# EAGLE board sinobit (EAGLE 6.1), part 1 of 2
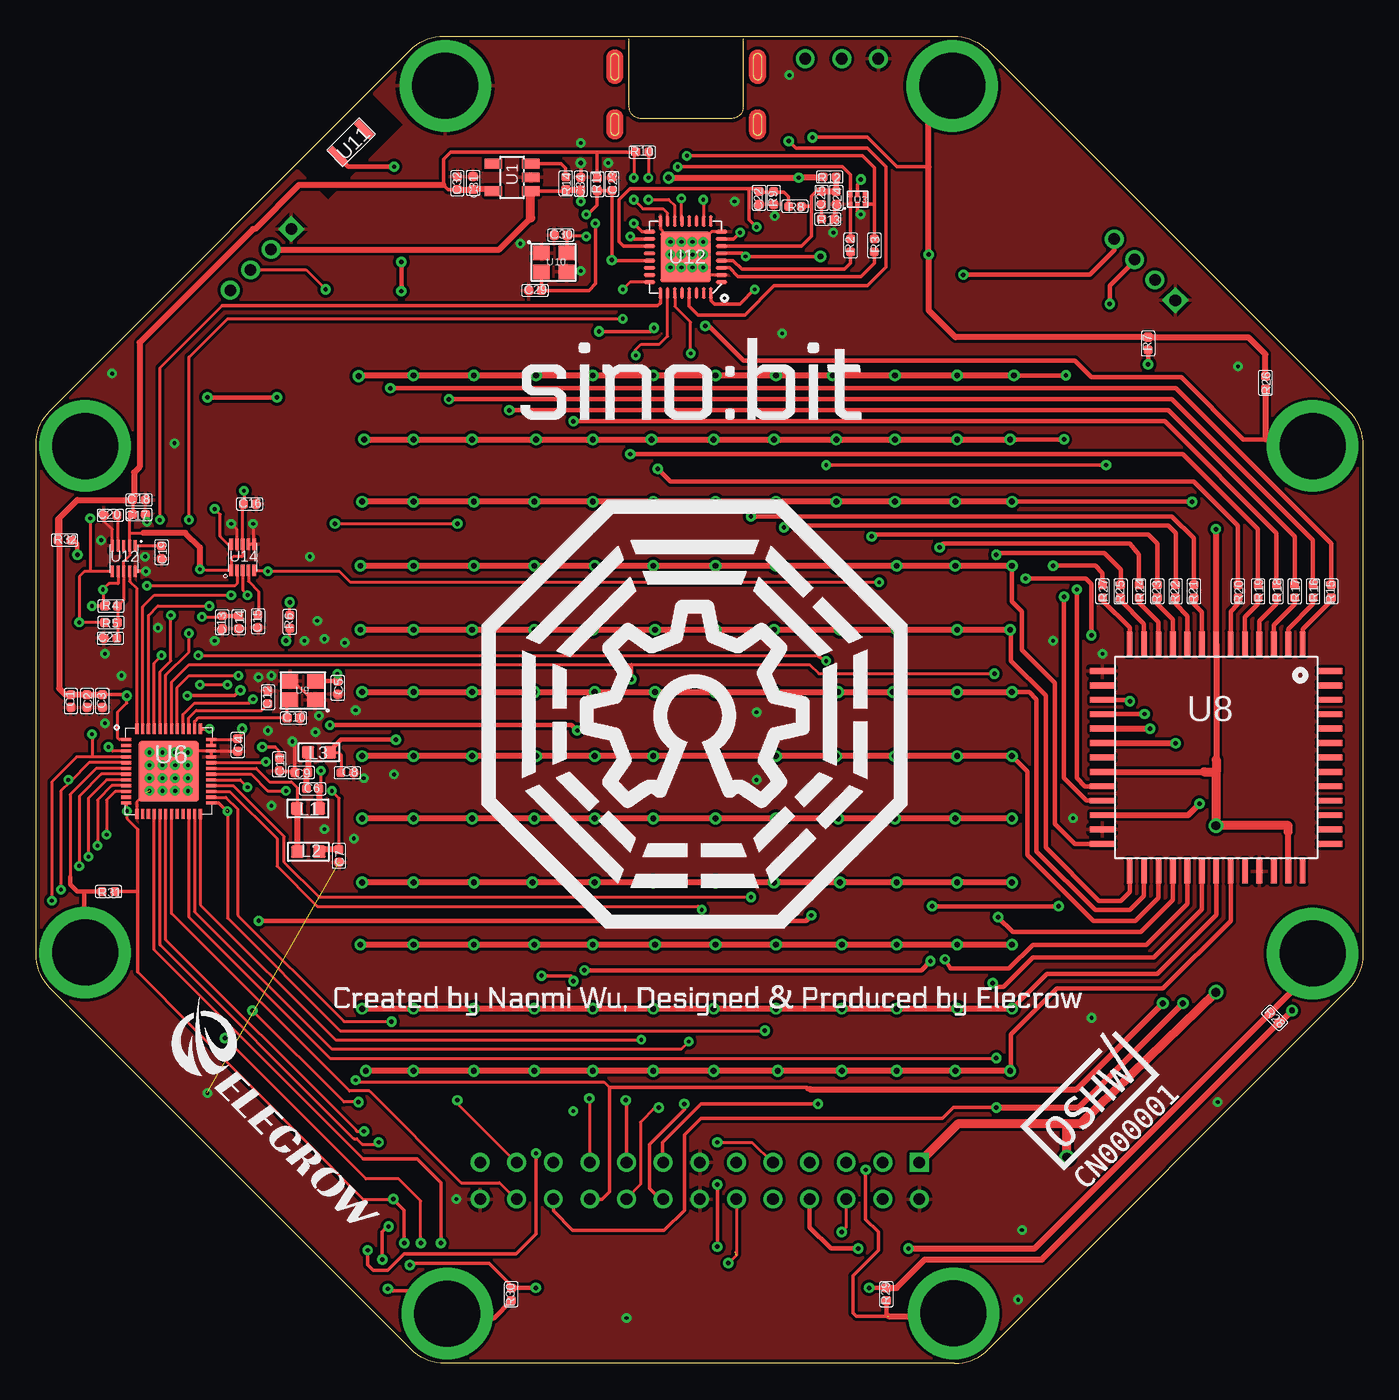
[diagram p2: board, top side]
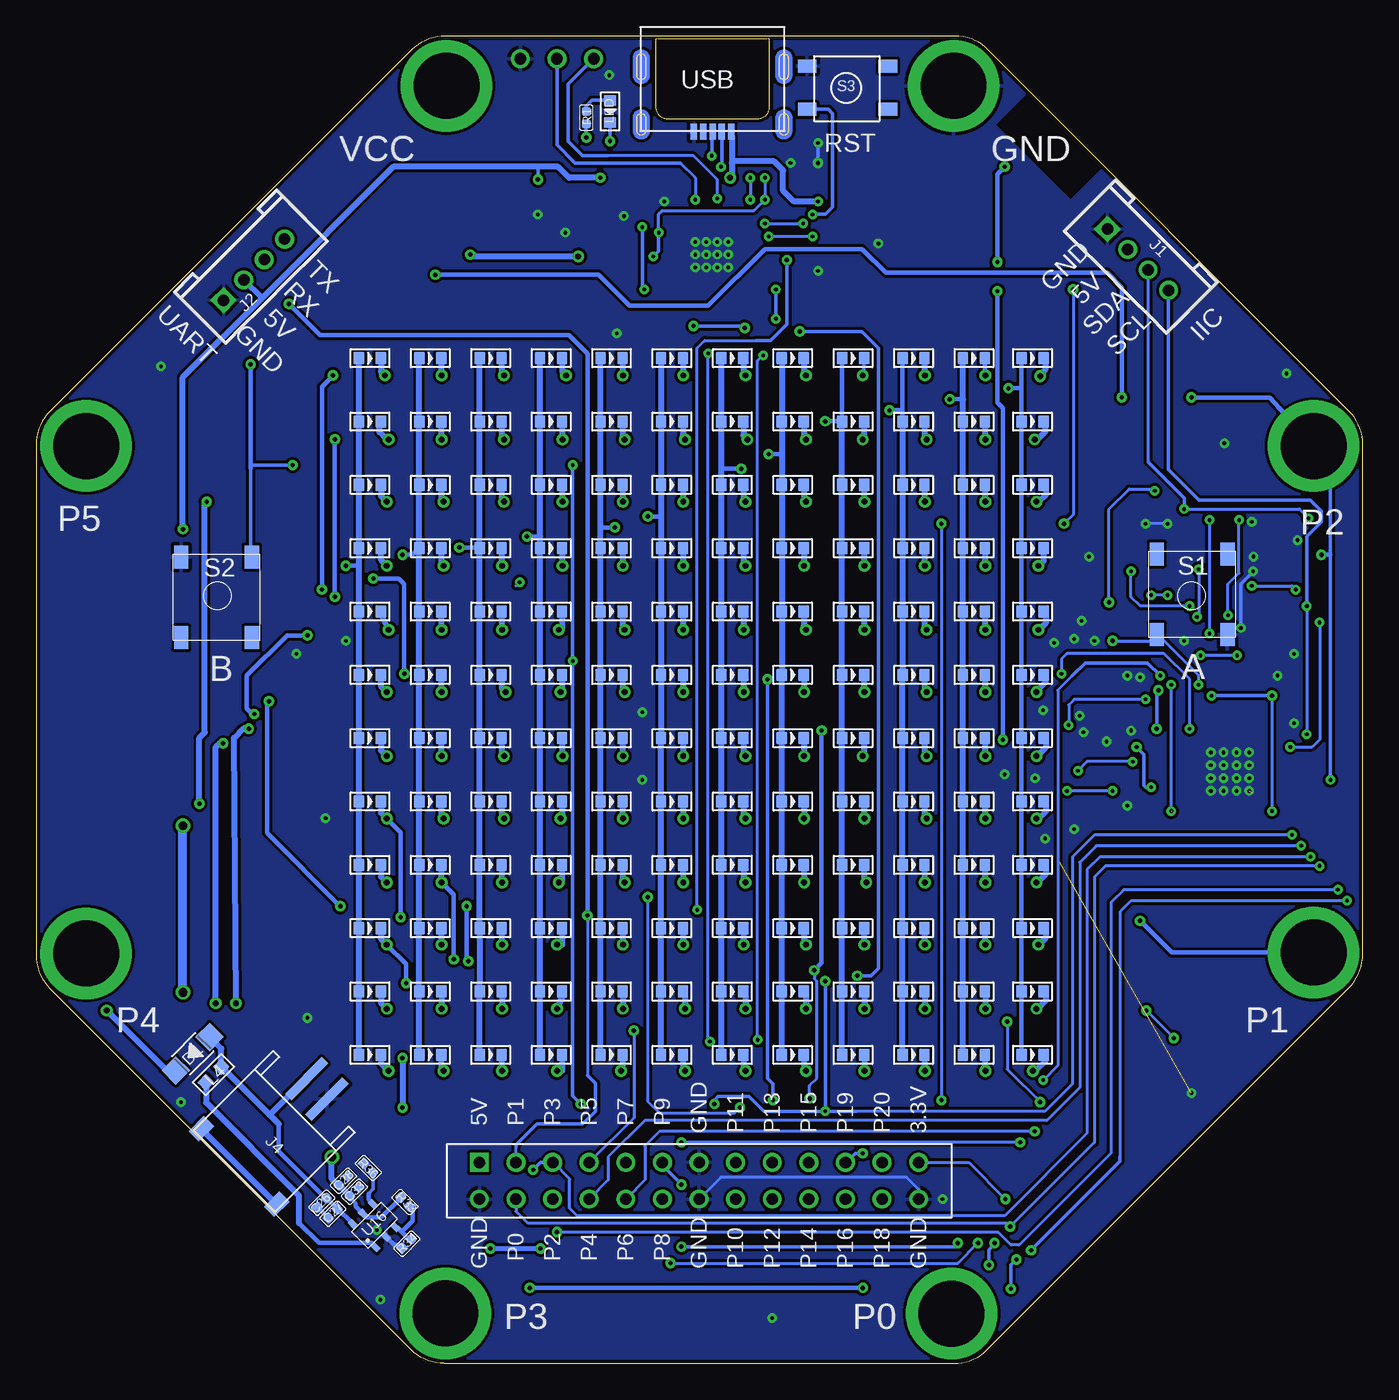
[diagram p3: board, bottom side, seen from below]

Size 92.05 x 92.1 mm. Coordinates in mm from the lower left corner, seen from the top.
Outline: 63.73,0 28.37,0 arc-45 26.03,0.97 0.97,26.06 arc-45 0,28.39 0,63.76 arc-45 0.97,66.09 25.96,91.13 arc-45 28.29,92.1 63.66,92.1 arc-45 65.99,91.13 91.08,66.07 arc-45 92.05,63.73 92.05,28.37 arc-45 91.08,26.03 66.07,0.97 arc-45 63.73,0
Copper layers (1*16): Top 0.035mm / dielectric 1.5mm / Bottom 0.035mm
Design rules: minimum track width 8mil, minimum drill 8mil, track to track 8mil, track to pad 8mil, pad to pad 8mil, via to via 8mil, smd to smd 0mil, copper to edge 10mil, drill to drill 8mil, minimum pad ring 10mil, minimum via ring 8mil, stop-mask expansion 4mil, vias tented up to drill 100mil, thermal gap 10mil
Net classes: 0 default: width 0.003 mm, drill 0.254 mm, clearance 0.152 mm

## Footprints (pad centres in the part's own frame; a part is rotated, then mirrored left to right if it is on the bottom)
C0402 = smd 0.635 x 0.635: 1 -0.445,0; 2 0.445,0
SOD123 = smd 1.397 x 1.397: + -1.651,0; - 1.651,0
D0603 = smd 0.762 x 0.889: + -0.762,0; - 0.762,0
2.0_1X4 = drill 0.8 pad 1.27 square: 1 -3,0 | drill 0.8 pad 1.27: 2 -1,0; 3 1,0; 4 3,0
JST-SMD-2.0-90D = smd 1 x 1.5: 3 3.7,-2.54; 4 -3.7,-2.54 | smd 0.635 x 3.6: + -1,5.08; - 1,5.08
L0603 = smd 0.889 x 0.889: 1 -0.762,0; 2 0.762,0
R0402 = smd 0.635 x 0.635: 1 -0.445,0; 2 0.445,0
SWITCH = smd 1.6 x 1: 1 -2.7,2.4; 2 2.9,2.4; 3 -2.7,-2.5; 4 2.9,-2.5
SWITC4.5X4.5 = smd 1.3 x 0.9: P$1 -0.5,3.8; P$2 -0.5,0.8; P$3 5.1,0.8; P$4 5.1,3.8
SOT23-5 = smd 0.69 x 1.2: 1 -0.95,-1.3; 2 0,-1.3; 3 0.95,-1.3; 4 0.95,1.3; 5 -0.95,1.3
MAG3110 = smd 0.8 x 0.22: P1 -0.816,0.846; P2 -0.816,0.446; P3 -0.816,0.046; P4 -0.816,-0.354; P5 -0.816,-0.754; P6 0.984,-0.754; P7 0.984,-0.354; P8 0.984,0.046; P9 0.984,0.446; P10 0.984,0.846
PRTR5V0U2F_SOT886 = smd 0.325 x 0.27: P1 -0.3,0.5; P2 -0.3,0; P3 -0.3,-0.5; P4 0.375,-0.5; P5 0.375,0; P6 0.375,0.5
NRF51822 = smd 0.7 x 0.22: 1 -2.95,2; 2 -2.95,1.6; 3 -2.95,1.2; 4 -2.95,0.8; 5 -2.95,0.4; 6 -2.95,0; 7 -2.95,-0.4; 8 -2.95,-0.8; 9 -2.95,-1.2; 10 -2.95,-1.6; 11 -2.95,-2; 12 -2.95,-2.4; 25 2.95,-2.4; 26 2.95,-2; 27 2.95,-1.6; 28 2.95,-1.2; 29 2.95,-0.8; 30 2.95,-0.4; 31 2.95,0; 32 2.95,0.4; 33 2.95,0.8; 34 2.95,1.2; 35 2.95,1.6; 36 2.95,2 | smd 0.22 x 0.7: 13 -2.2,-3.15; 14 -1.8,-3.15; 15 -1.4,-3.15; 16 -1,-3.15; 17 -0.6,-3.15; 18 -0.2,-3.15; 19 0.2,-3.15; 20 0.6,-3.15; 21 1,-3.15; 22 1.4,-3.15; 23 1.8,-3.15; 24 2.2,-3.15; 37 2.2,2.75; 38 1.8,2.75; 39 1.4,2.75; 40 1,2.75; 41 0.6,2.75; 42 0.2,2.75; 43 -0.2,2.75; 44 -0.6,2.75; 45 -1,2.75; 46 -1.4,2.75; 47 -1.8,2.75; 48 -2.2,2.75 | smd 4.2 x 4.2: P$14 0,-0.2
HT1632C = smd 0.4 x 1.7: P$8 -5.35,-7.25; P$9 -4.35,-7.25; P$10 -3.35,-7.25; P$11 -2.35,-7.25; P$12 -1.35,-7.25; P$13 -0.35,-7.25; P$14 0.65,-7.25; P$15 1.65,-7.25; P$16 2.65,-7.25; P$17 3.65,-7.25; P$18 4.65,-7.25; P$19 5.65,-7.25; P$20 6.65,-7.25; P$34 -5.35,8.55; P$35 -4.35,8.55; P$36 -3.35,8.55; P$37 -2.35,8.55; P$38 -1.35,8.55; P$39 -0.35,8.55; P$40 0.65,8.55; P$41 1.65,8.55; P$42 2.65,8.55; P$43 3.65,8.55; P$44 4.65,8.55; P$45 5.65,8.55; P$46 6.65,8.55 | smd 1.7 x 0.4: P$21 8.55,-5.35; P$22 8.55,-4.35; P$23 8.55,-3.35; P$24 8.55,-2.35; P$25 8.55,-1.35; P$26 8.55,-0.35; P$27 8.55,0.65; P$28 8.55,1.65; P$29 8.55,2.65; P$30 8.55,3.65; P$31 8.55,4.65; P$32 8.55,5.65; P$33 8.55,6.65; P$47 -7.25,-5.35; P$48 -7.25,-4.35; P$49 -7.25,-3.35; P$50 -7.25,-2.35; P$51 -7.25,-1.35; P$52 -7.25,-0.35; P$53 -7.25,0.65; P$54 -7.25,1.65; P$55 -7.25,2.65; P$56 -7.25,3.65; P$57 -7.25,4.65; P$58 -7.25,5.65; P$59 -7.25,6.65
16MHZ2520 = smd 1.15 x 1: 1 2.6,0; 2 4.35,0; 3 4.35,1.3; 4 2.6,1.3
TIANXIAN = smd 0.5 x 1.47: P$1 0.3,0.8; P$2 2.9,0.8
MKL26Z168VFM4 = smd 0.8 x 0.27: 1 -2.6,1.75; 2 -2.6,1.25; 3 -2.6,0.75; 4 -2.6,0.25; 5 -2.6,-0.25; 6 -2.6,-0.75; 7 -2.6,-1.25; 8 -2.6,-1.75; 17 2.4,-1.75; 18 2.4,-1.25; 19 2.4,-0.75; 20 2.4,-0.25; 21 2.4,0.25; 22 2.4,0.75; 23 2.4,1.25; 24 2.4,1.75 | smd 0.27 x 0.8: 9 -1.85,-2.5; 10 -1.35,-2.5; 11 -0.85,-2.5; 12 -0.35,-2.5; 13 0.15,-2.5; 14 0.65,-2.5; 15 1.15,-2.5; 16 1.65,-2.5; 25 1.65,2.5; 26 1.15,2.5; 27 0.65,2.5; 28 0.15,2.5; 29 -0.35,2.5; 30 -0.85,2.5; 32 -1.85,2.5 | smd 0.26 x 0.8: 31 -1.35,2.5 | smd 3.5 x 3.5: P$9 -0.1,0
MMA8653FC = smd 0.8 x 0.26: 6 1.92,0.2; 7 1.92,0.6; 8 1.92,1; 9 1.92,1.4; 10 1.92,1.8; P1 0.1,1.8; P2 0.1,1.4; P3 0.1,1; P4 0.1,0.6; P5 0.1,0.2
PS7516 = smd 0.4 x 0.6: P1 -1.07,-1.14; P2 -0.05,-1.14; P3 0.9,-1.14; P4 0.9,1.14; P5 -0.05,1.14; P6 -1.07,1.14
PAD-D = drill 0.8: P$1 0,0
26PIN = drill 0.8 square: P$1 0,0 | drill 0.8: P$2 2.54,0; P$3 5.08,0; P$4 7.62,0; P$5 10.16,0; P$6 12.7,0; P$7 15.24,0; P$8 17.78,0; P$9 20.32,0; P$10 22.86,0; P$11 25.4,0; P$12 27.94,0; P$13 30.48,0; P$14 30.48,-2.54; P$15 27.94,-2.54; P$16 25.4,-2.54; P$17 22.86,-2.54; P$18 20.32,-2.54; P$19 17.78,-2.54; P$20 15.24,-2.54; P$21 12.7,-2.54; P$22 10.16,-2.54; P$23 7.62,-2.54; P$24 5.08,-2.54; P$25 2.54,-2.54; P$26 0,-2.54
焊盘1 = drill 4.572 pad 6.35: P$1 0,0
47642-0001 = smd 0.45 x 1.1: 1 -1.3,6.47; 2 -0.65,6.47; 3 0,6.47; 4 0.65,6.47; 5 1.3,6.47

## Placement (x,y rotation side)
C1  4.7uf  [C0402]  2.42,45.96 90 top
C2  100nf  [C0402]  3.53,45.96 90 top
C3  100nf  [C0402]  4.6,45.96 90 top
C4  100nf  [C0402]  13.99,42.91 90 top
C5  12pF  [C0402]  20.93,46.88 270 top
C6  2.2pf  [C0402]  19.19,39.87 180 top
C7  2.2nf  [C0402]  21.02,35.22 270 top
C8  1.5pf  [C0402]  21.6,40.98 0 top
C9  0.8pf  [C0402]  18.4,41.01 180 top
C10  12pF  [C0402]  17.87,44.78 0 top
C11  47nF  [C0402]  16.87,41.57 270 top
C12  100nF  [C0402]  16.1,46.21 90 top
C13  100nF  [C0402]  12.92,51.42 90 top
C14  1uF  [C0402]  14.06,51.42 90 top
C15  100nF  [C0402]  15.4,51.5 90 top
C16  100nF  [C0402]  14.82,59.63 0 top
C17  100nF  [C0402]  7.14,58.9 180 top
C18  1uF  [C0402]  7.14,59.92 180 top
C19  100nF  [C0402]  8.71,56.29 270 top
C20  100nF  [C0402]  5.16,58.85 0 top
C21  100nF  [C0402]  5.16,50.32 0 top
C22  100nF  [C0402]  50.16,80.87 90 top
C23  100nF  [C0402]  39.95,81.84 270 top
C24  100nF  [C0402]  55.52,80.87 90 top
C25  1uF  [C0402]  54.51,80.87 90 top
C26  0.1uF  [C0402]  72.21,11.15 45 bottom
C27  10uF  [C0402]  71.45,10.39 45 bottom
C28  0.1uF  [C0402]  70.71,12.67 225 bottom
C29  6.8pF  [C0402]  34.62,74.45 0 top
C30  6.8pF  [C0402]  36.4,78.28 0 top
C31  1uF  [C0402]  30.32,81.9 270 top
C32  10uF  [C0402]  29.24,81.89 270 top
C33  10uF  [C0402]  69.95,11.91 225 bottom
C34  10uF  [C0402]  37.8,81.85 270 top
D1  MBR0520  [SOD123]  81.18,21.49 225 bottom
E$1  [文字]  20.27,23.47 0 top
E$2  [SINOBIT2]  32.59,64.87 0 top
E$3  [ELECEOW]  8.08,22.45 315 top
E$4  [SINOBIT编号]  72.97,11.66 45 top
E$5  [XXX]  30.94,30.2 0 top
EB  RED  [D0603]  68.88,69.75 0 bottom
EB1  RED  [D0603]  68.88,65.35 0 bottom
EB2  RED  [D0603]  68.88,60.96 0 bottom
EB3  RED  [D0603]  68.88,56.57 0 bottom
EB4  RED  [D0603]  68.88,52.17 0 bottom
EB5  RED  [D0603]  68.88,47.78 0 bottom
EB6  RED  [D0603]  68.88,43.38 0 bottom
EB7  RED  [D0603]  68.88,38.99 0 bottom
EB8  RED  [D0603]  68.88,34.59 0 bottom
EB9  RED  [D0603]  68.88,30.2 0 bottom
EB10  RED  [D0603]  68.88,25.81 0 bottom
EB11  RED  [D0603]  68.88,21.41 0 bottom
EB12  RED  [D0603]  64.69,69.75 0 bottom
EB13  RED  [D0603]  64.69,65.35 0 bottom
EB14  RED  [D0603]  64.69,60.96 0 bottom
EB15  RED  [D0603]  64.69,56.57 0 bottom
EB16  RED  [D0603]  64.69,52.17 0 bottom
EB17  RED  [D0603]  64.69,47.78 0 bottom
EB18  RED  [D0603]  64.69,43.38 0 bottom
EB19  RED  [D0603]  64.69,38.99 0 bottom
EB20  RED  [D0603]  64.69,34.59 0 bottom
EB21  RED  [D0603]  64.69,30.2 0 bottom
EB22  RED  [D0603]  64.69,25.81 0 bottom
EB23  RED  [D0603]  64.69,21.41 0 bottom
EB24  RED  [D0603]  60.5,69.75 0 bottom
EB25  RED  [D0603]  60.5,65.35 0 bottom
EB26  RED  [D0603]  60.5,60.96 0 bottom
EB27  RED  [D0603]  60.5,56.57 0 bottom
EB28  RED  [D0603]  60.5,52.17 0 bottom
EB29  RED  [D0603]  60.5,47.78 0 bottom
EB30  RED  [D0603]  60.5,43.38 0 bottom
EB31  RED  [D0603]  60.5,38.99 0 bottom
EB32  RED  [D0603]  60.5,34.59 0 bottom
EB33  RED  [D0603]  60.5,30.2 0 bottom
EB34  RED  [D0603]  60.5,25.81 0 bottom
EB35  RED  [D0603]  60.5,21.41 0 bottom
EB36  RED  [D0603]  56.31,69.75 0 bottom
EB37  RED  [D0603]  56.31,65.35 0 bottom
EB38  RED  [D0603]  56.31,60.96 0 bottom
EB39  RED  [D0603]  56.31,56.57 0 bottom
EB40  RED  [D0603]  56.31,52.17 0 bottom
EB41  RED  [D0603]  56.31,47.78 0 bottom
EB42  RED  [D0603]  56.31,43.38 0 bottom
EB43  RED  [D0603]  56.31,38.99 0 bottom
EB44  RED  [D0603]  56.31,34.59 0 bottom
EB45  RED  [D0603]  56.31,30.2 0 bottom
EB46  RED  [D0603]  56.31,25.81 0 bottom
EB47  RED  [D0603]  56.31,21.41 0 bottom
EB48  RED  [D0603]  52.12,69.75 0 bottom
EB49  RED  [D0603]  52.12,65.35 0 bottom
EB50  RED  [D0603]  52.12,60.96 0 bottom
EB51  RED  [D0603]  52.12,56.57 0 bottom
EB52  RED  [D0603]  52.12,52.17 0 bottom
EB53  RED  [D0603]  52.12,47.78 0 bottom
EB54  RED  [D0603]  52.12,43.38 0 bottom
EB55  RED  [D0603]  52.12,38.99 0 bottom
EB56  RED  [D0603]  52.12,34.59 0 bottom
EB57  RED  [D0603]  52.12,30.2 0 bottom
EB58  RED  [D0603]  52.12,25.81 0 bottom
EB59  RED  [D0603]  52.12,21.41 0 bottom
EB60  RED  [D0603]  47.93,69.75 0 bottom
EB61  RED  [D0603]  47.93,65.35 0 bottom
EB62  RED  [D0603]  47.93,60.96 0 bottom
EB63  RED  [D0603]  47.93,56.57 0 bottom
EB64  RED  [D0603]  47.93,52.17 0 bottom
EB65  RED  [D0603]  47.93,47.78 0 bottom
EB66  RED  [D0603]  47.93,43.38 0 bottom
EB67  RED  [D0603]  47.93,38.99 0 bottom
EB68  RED  [D0603]  47.93,34.59 0 bottom
EB69  RED  [D0603]  47.93,30.2 0 bottom
EB70  RED  [D0603]  47.93,25.81 0 bottom
EB71  RED  [D0603]  47.93,21.41 0 bottom
EB72  RED  [D0603]  43.74,69.75 0 bottom
EB73  RED  [D0603]  43.74,65.35 0 bottom
EB74  RED  [D0603]  43.74,60.96 0 bottom
EB75  RED  [D0603]  43.74,56.57 0 bottom
EB76  RED  [D0603]  43.74,52.17 0 bottom
EB77  RED  [D0603]  43.74,47.78 0 bottom
EB78  RED  [D0603]  43.74,43.38 0 bottom
EB79  RED  [D0603]  43.74,38.99 0 bottom
EB80  RED  [D0603]  43.74,34.59 0 bottom
EB81  RED  [D0603]  43.74,30.2 0 bottom
EB82  RED  [D0603]  43.74,25.81 0 bottom
EB83  RED  [D0603]  43.74,21.41 0 bottom
EB84  RED  [D0603]  39.55,69.75 0 bottom
EB85  RED  [D0603]  39.55,65.35 0 bottom
EB86  RED  [D0603]  39.55,60.96 0 bottom
EB87  RED  [D0603]  39.55,56.57 0 bottom
EB88  RED  [D0603]  39.55,52.17 0 bottom
EB89  RED  [D0603]  39.55,47.78 0 bottom
EB90  RED  [D0603]  39.55,43.38 0 bottom
EB91  RED  [D0603]  39.55,38.99 0 bottom
EB92  RED  [D0603]  39.55,34.59 0 bottom
EB93  RED  [D0603]  39.55,30.2 0 bottom
EB94  RED  [D0603]  39.55,25.81 0 bottom
EB95  RED  [D0603]  39.55,21.41 0 bottom
EB96  RED  [D0603]  35.36,69.75 0 bottom
EB97  RED  [D0603]  35.36,65.35 0 bottom
EB98  RED  [D0603]  35.36,60.96 0 bottom
EB99  RED  [D0603]  35.36,56.57 0 bottom
EB100  RED  [D0603]  35.36,52.17 0 bottom
EB101  RED  [D0603]  35.36,47.78 0 bottom
EB102  RED  [D0603]  35.36,43.38 0 bottom
EB103  RED  [D0603]  35.36,38.99 0 bottom
EB104  RED  [D0603]  35.36,34.59 0 bottom
EB105  RED  [D0603]  35.36,30.2 0 bottom
EB106  RED  [D0603]  35.36,25.81 0 bottom
EB107  RED  [D0603]  35.36,21.41 0 bottom
EB108  RED  [D0603]  31.17,69.75 0 bottom
EB109  RED  [D0603]  31.17,65.35 0 bottom
EB110  RED  [D0603]  31.17,60.96 0 bottom
EB111  RED  [D0603]  31.17,56.57 0 bottom
EB112  RED  [D0603]  31.17,52.17 0 bottom
EB113  RED  [D0603]  31.17,47.78 0 bottom
EB114  RED  [D0603]  31.17,43.38 0 bottom
EB115  RED  [D0603]  31.17,38.99 0 bottom
EB116  RED  [D0603]  31.17,34.59 0 bottom
EB117  RED  [D0603]  31.17,30.2 0 bottom
EB118  RED  [D0603]  31.17,25.81 0 bottom
EB119  RED  [D0603]  31.17,21.41 0 bottom
EB120  RED  [D0603]  26.97,69.75 0 bottom
EB121  RED  [D0603]  26.97,65.35 0 bottom
EB122  RED  [D0603]  26.97,60.96 0 bottom
EB123  RED  [D0603]  26.97,56.57 0 bottom
EB124  RED  [D0603]  26.97,52.17 0 bottom
EB125  RED  [D0603]  26.97,47.78 0 bottom
EB126  RED  [D0603]  26.97,43.38 0 bottom
EB127  RED  [D0603]  26.97,38.99 0 bottom
EB128  RED  [D0603]  26.97,34.59 0 bottom
EB129  RED  [D0603]  26.97,30.2 0 bottom
EB130  RED  [D0603]  26.97,25.81 0 bottom
EB131  RED  [D0603]  26.97,21.41 0 bottom
EB132  RED  [D0603]  22.91,69.75 0 bottom
EB133  RED  [D0603]  22.91,65.35 0 bottom
EB134  RED  [D0603]  22.91,60.96 0 bottom
EB135  RED  [D0603]  22.91,56.57 0 bottom
EB136  RED  [D0603]  22.91,52.17 0 bottom
EB137  RED  [D0603]  22.91,47.78 0 bottom
EB138  RED  [D0603]  22.91,43.38 0 bottom
EB139  RED  [D0603]  22.91,38.99 0 bottom
EB140  RED  [D0603]  22.91,34.59 0 bottom
EB141  RED  [D0603]  22.91,30.2 0 bottom
EB142  RED  [D0603]  22.91,25.81 0 bottom
EB143  RED  [D0603]  22.91,21.41 0 bottom
J1  TWIG_2.0  [2.0_1X4]  15.6,76.59 315 bottom
J2  TWIG_2.0  [2.0_1X4]  76.93,75.89 45 bottom
J4  [JST-SMD-2.0-90D]  76.17,15.46 315 bottom
L1  4.7nH  [L0603]  18.87,38.51 180 top
L2  10nH  [L0603]  18.9,35.5 0 top
L3  3.3nH  [L0603]  19.63,42.41 180 top
L4  10uH  [L0603]  79.73,20.04 225 bottom
LED  blue  [D0603]  52.22,86.87 270 bottom
R1  200R  [R0402]  53.87,86.44 90 bottom
R2  33R  [R0402]  56.52,77.57 90 top
R3  33R  [R0402]  58.17,77.57 90 top
R4  4K7  [R0402]  5.21,52.55 0 top
R5  4k7  [R0402]  5.21,51.41 0 top
R6  10K  [R0402]  17.6,51.46 90 top
R7  10K  [R0402]  77.17,70.76 90 top
R8  6K2  [R0402]  52.65,80.29 180 top
R9  10K  [R0402]  51.18,80.87 90 top
R10  10K  [R0402]  42.06,84.05 180 top
R11  10K  [R0402]  38.94,81.81 90 top
R12  10K  [R0402]  55.07,82.32 180 top
R13  0R  [R0402]  54.94,79.4 0 top
R14  8.1K  [R0402]  36.75,81.88 270 top
R15  200R  [R0402]  89.87,53.57 270 top
R16  200R  [R0402]  88.6,53.57 270 top
R17  200R  [R0402]  87.33,53.57 270 top
R18  200R  [R0402]  86.06,53.57 270 top
R19  200R  [R0402]  84.79,53.57 270 top
R20  200R  [R0402]  83.39,53.57 270 top
R21  200R  [R0402]  80.34,53.57 270 top
R22  200R  [R0402]  79.07,53.57 270 top
R23  200R  [R0402]  77.8,53.57 270 top
R24  200R  [R0402]  76.53,53.57 270 top
R25  200R  [R0402]  75.26,53.57 270 top
R26  2M  [R0402]  85.29,68.05 270 top
R27  200R  [R0402]  73.99,53.57 270 top
R28  2M  [R0402]  85.93,23.98 135 top
R29  2M  [R0402]  59,4.8 270 top
R30  2M  [R0402]  32.97,4.8 270 top
R31  2M  [R0402]  5.03,32.74 180 top
R32  2M  [R0402]  1.98,57.12 0 top
R33  510k  [R0402]  66.45,11.2 315 bottom
R34  100K  [R0402]  66.32,8.31 225 bottom
R36  200  [R0402]  68.99,13.56 315 bottom
S1  SWITCH  [SWITCH]  11.89,53.26 90 bottom
S2  SWITCH  [SWITCH]  79.48,53.26 270 bottom
S3  SWITCH4.5X4.5  [SWITC4.5X4.5]  38.05,86.21 0 bottom
U1  SPX3819  [SOT23-5]  33.03,82.29 90 top
U2  [MAG3110]  6.05,55.93 270 top
U3  [PRTR5V0U2F_SOT886]  57,80.72 90 top
U6  IC_NRF51822_MODULE  [NRF51822]  9.2,41.29 0 top
U8  HT1632C_QFP52  [HT1632C]  81.23,42.7 270 top
U9  16MHZ2520  [16MHZ2520]  21.97,47.35 180 top
U10  16MHZ2520  [16MHZ2520]  32.46,75.74 0 top
U11  TIANXIAN  [TIANXIAN]  21.29,83.03 45 top
U12  IC_MKL26Z128VFM4  [MKL26Z168VFM4]  44.97,76.77 180 top
U14  IC_MMA8653FCR1  [MMA8653FC]  15.34,54.93 90 top
U16  PS7516  [PS7516]  68.53,9.63 45 bottom
U$1  PAD-D  [PAD-D]  55.91,90.53 0 bottom
U$4  PAD-D  [PAD-D]  53.37,90.53 0 bottom
U$6  PAD-D  [PAD-D]  58.45,90.53 0 bottom
U$12  26PIN  [26PIN]  61.29,13.94 0 bottom
U$35  焊盘1  [焊盘1]  3.4,28.51 0 top
U$39  焊盘1  [焊盘1]  3.4,63.65 0 top
U$46  焊盘1  [焊盘1]  28.38,88.65 0 top
U$48  焊盘1  [焊盘1]  88.57,63.65 0 top
U$49  焊盘1  [焊盘1]  88.57,28.45 0 top
U$50  焊盘1  [焊盘1]  63.65,3.48 0 top
U$51  焊盘1  [焊盘1]  28.52,3.45 0 top
U$52  焊盘1  [焊盘1]  63.58,88.65 0 top
USB  47642-0001  [47642-0001]  45.11,91.92 180 bottom